# Altium schematic sheet Raspberry.SchDoc
size A4; DocumentNumber: 4; SheetNumber: 4; SheetTotal: 4
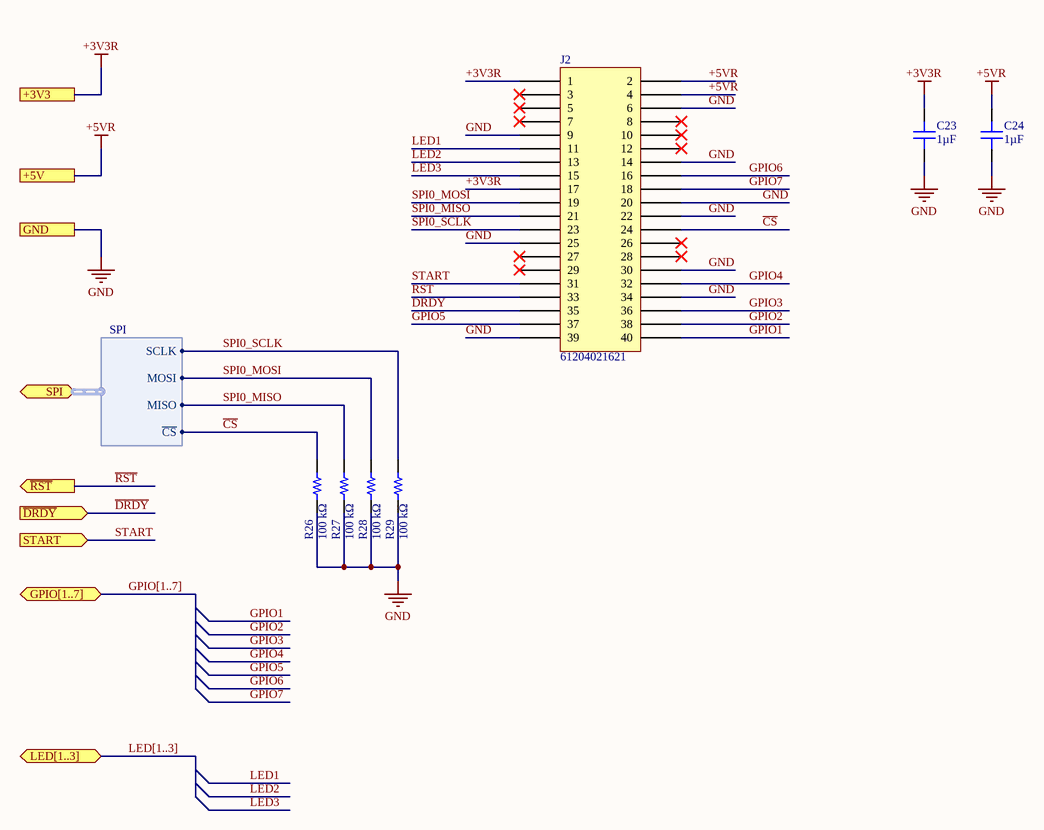
[diagram p0: Raspberry.SchDoc]

## Parts
C23  1µF  [CAP 0402_1005]
C24  1µF  [CAP 0402_1005]
J2  61204021621  [WURTH 61204021621]
R26  100 kΩ  [RES 0402_1005]
R27  100 kΩ  [RES 0402_1005]
R28  100 kΩ  [RES 0402_1005]
R29  100 kΩ  [RES 0402_1005]

## Ports
+3V3, +5V, GND, GPIO[1..7] (bidir), LED[1..3] (bidir), SPI (bidir, harness SPI), START (in), ~{DRDY} (in), ~{RST} (out)

## Harnesses
SPI: SCLK, MOSI, MISO, ~{CS}

## Nets
+3V3R: C23.1 J2.1 J2.17 ; port +3V3
+5VR: C24.1 J2.2 J2.4 ; port +5V
GND: C23.2 C24.2 J2.6 J2.9 J2.14 J2.20 J2.22 J2.25 J2.30 J2.34 J2.39 R26.2 R27.2 R28.2 R29.2 ; port GND
~{CS}: J2.24 R26.1 ; port SPI.~{CS}
~{DRDY}: J2.35 ; port ~{DRDY}
GPIO1: J2.40
GPIO2: J2.38
GPIO3: J2.36
GPIO4: J2.32
GPIO5: J2.37
GPIO6: J2.16
GPIO7: J2.18
LED1: J2.11
LED2: J2.13
LED3: J2.15
~{RST}: J2.33 ; port ~{RST}
SPI0_MISO: J2.21 R27.1 ; port SPI.MISO
SPI0_MOSI: J2.19 R28.1 ; port SPI.MOSI
SPI0_SCLK: J2.23 R29.1 ; port SPI.SCLK
START: J2.31 ; port START

Not connected (* = marked no-connect by the designer): J2 3* 5* 7* 8* 10* 12* 26* 27* 28* 29*

## Buses and harness runs
bus GPIO[1..7] = port GPIO[1..7]
bus LED[1..3] = port LED[1..3]

## Library data of the parts
C23 C24 = 0402BW105K160NGT: CAP CER 1UF 16V X5R 0402; Manufacturer: Knowles Novacap; Tolerance: ±10%; Part Number: 0402BW105K160NGT; Applications: General Purpose; Capacitance: 1µF; ComponentLink1Description: Datasheet; ComponentLink1URL: https://www.knowlescapacitors.com/getattachment/6c8d48ef-fc2b-4752-ae2c-ce6c208de0c4/High-Capacitance-Chip.aspx; ComponentLink2Description: DigiKey Link; ComponentLink2URL: http://digikey.com/product-detail/en/knowles-novacap/0402BW105K160NGT/1763-1163-1-ND/7304074; Device Package: 0402 (1005 Metric); Features: Gold Flash Termination; LastUpdated: 2020-02-03 5:04:03 PM; Lifecycle Status: Active; Minimum Order: 1; Mounting Type: Surface Mount, MLCC; Operating Temperature: -55°C ~ 85°C; Package / Case: 0402 (1005 Metric); Packaging: TapeAndReel; Part Status: Active; Price: 0.71; Series: -; Size / Dimension: 0.040" L x 0.020" W (1.02mm x 0.51mm); Supplier 1: DigiKey; Supplier Part Number 1: 1763-1163-1-ND; Temperature Coefficient: X5R; Thickness (Max): 0.024" (0.61mm); Value: 1µF; Voltage - Rated: 16V
J2 = 61204021621: CONN HEADER VERT 40POS 2.54MM; Manufacturer: Würth Elektronik; Current Rating (Amps): 1A; Material Flammability Rating: UL94 V-0; Number of Positions: 40; Number of Positions Loaded: All; Pitch - Mating: 0.100" (2.54mm); Shrouding: Shrouded - 4 Wall; Style: Board to Cable/Wire; Voltage Rating: 250V; Part Number: 61204021621; ComponentLink1Description: Datasheet; ComponentLink1URL: https://media.digikey.com/pdf/Data%20Sheets/Wurth%20Electronics%20PDFs/Box%20Header_IDC%20Conn%20WR-BHD.pdf; ComponentLink2Description: DigiKey Link; ComponentLink2URL: https://www.digikey.com/product-detail/en/w%C3%BCrth-elektronik/61204021621/732-5401-ND/4846944; Connector Type: Header; Contact Finish - Mating: Gold; Contact Finish - Post: Tin; Contact Material: Copper Alloy; Contact Shape: Rectangular; Contact Type: Male Pin; Fastening Type: Push-Pull; Features: Keying Slot; Insulation Color: Black; Insulation Height: 0.358" (9.10mm); Insulation Material: Polybutylene Terephthalate (PBT); LastUpdated: 2020-08-18 7:30:17 PM; Lifecycle Status: Active; Minimum Order: 1; Mounting Type: Through Hole; Number of Rows: 2; Operating Temperature: -40°C ~ 125°C; Packaging: Tray; Part Status: Active; Price: 1.13; Series: WR-BHD; Supplier 1: DigiKey; Supplier Part Number 1: 61204021621; Termination: Solder
R26-R29 = AC0402FR-07100KL: RES SMD 100K OHM 1% 1/16W 0402; Manufacturer: Yageo; Power (Watts): 0.063W, 1/16W; Temperature Coefficient: ±100ppm/°C; Value: 100 kOhms; Part Number: AC0402FR-07100KL; ComponentLink1Description: Datasheet; ComponentLink1URL: https://www.yageo.com/upload/media/product/productsearch/datasheet/rchip/PYu-AC_51_RoHS_L_7.pdf; ComponentLink2Description: DigiKey Link; ComponentLink2URL: http://digikey.com/product-detail/en/yageo/AC0402FR-07100KL/YAG3434CT-ND/6006283; Composition: Thick Film; Device Package: 0402 (1005 Metric); Features: Automotive AEC-Q200, Moisture Resistant; Height - Seated (Max): 0.015" (0.37mm); LastUpdated: 2020-02-19 6:28:05 AM; Lifecycle Status: Active; Minimum Order: 1; Number of Terminations: 2; Operating Temperature: -55°C ~ 155°C; Package / Case: 0402 (1005 Metric); Packaging: CutTape; Part Status: Active; Price: 0.10; Ratings: AEC-Q200; Resistance: 100 kΩ; Series: AC; Size / Dimension: 0.039" L x 0.020" W (1.00mm x 0.50mm); Supplier 1: DigiKey; Supplier Part Number 1: YAG3434CT-ND; Supplier Device Package: 0402; Tolerance: ±1%